# Altium project debanew.PrjPcb
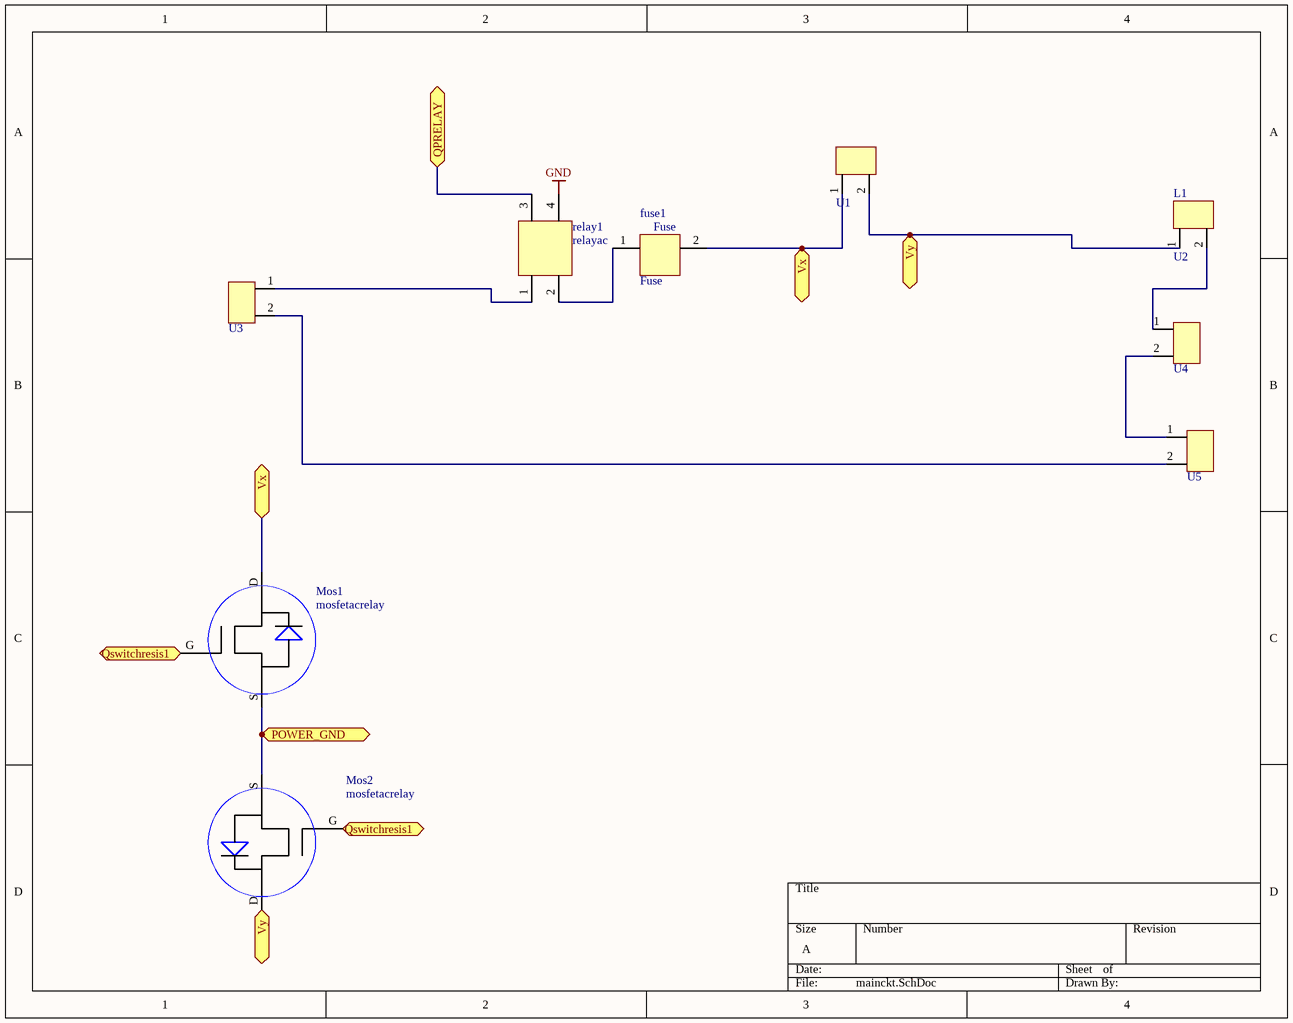
[diagram p0: mainckt.SchDoc]
3 sheets, 51 parts. Net scope: flat (ports and power ports of the same name join across sheets).
Board file: PCB24layer.PcbDoc
Sheets:
  mainckt.SchDoc
  dspinterface.SchDoc
  optoiso.SchDoc

## Sheet mainckt.SchDoc
size A

### Parts
fuse1  Fuse  [fuse10a]
Mos1  mosfetacrelay  [mosfet600v30A]
Mos2  mosfetacrelay  [mosfet600v30A]
relay1  relayac  [acrelay]
U1  Connector 60A  [newconn60A]  (value not drawn)
U2  L1  [newconn60A]
U3  Connector 60A  [newconn60A]  (value not drawn)
U4  Connector 60A  [newconn60A]  (value not drawn)
U5  Connector 60A  [newconn60A]  (value not drawn)

### Ports
POWER_GND (bidir), QPRELAY (bidir), Qswitchresis1 (bidir), Vx (bidir), Vy (bidir)

### Nets
GND: relay1.4
POWER_GND: Mos1.S Mos2.S ; port POWER_GND
Netfuse1_1: fuse1.1 relay1.2
Netfuse1_2: fuse1.2 Mos1.D U1.1 ; port Vx
NetGate_Driver1_6: relay1.3 ; port QPRELAY
NetMos1_G: Mos1.G Mos2.G ; port Qswitchresis1
NetMos2_D: Mos2.D U1.2 U2.1 ; port Vy
Netrelay1_1: relay1.1 U3.1
NetU2_2: U2.2 U4.1
NetU3_2: U3.2 U5.2
NetU4_2: U4.2 U5.1

### Library data of the parts
U2 = Connector 60A

## Sheet dspinterface.SchDoc
size A
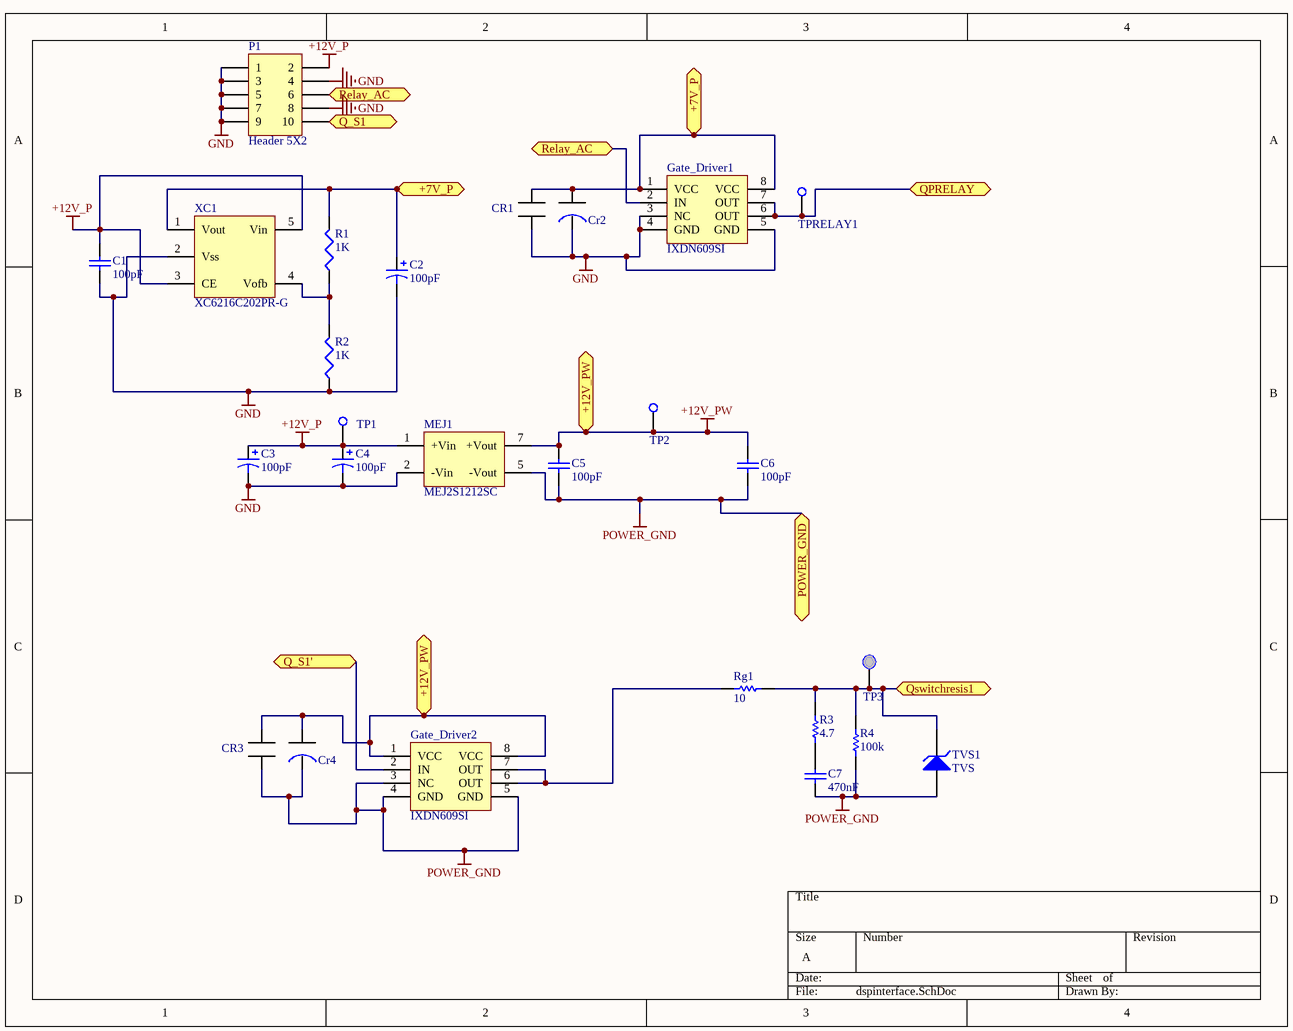
[diagram p1: dspinterface.SchDoc]

### Parts
C1  value 100pF  [C1206]  (hidden comment: Cap Semi)
C2  value 100pF  [C0805]  (hidden comment: Cap Pol3)
C3  value 100pF  [C0805]  (hidden comment: Cap Pol3)
C4  value 100pF  [C0805]  (hidden comment: Cap Pol3)
C5  value 100pF  [C1206]  (hidden comment: Cap Semi)
C6  value 100pF  [C1206]  (hidden comment: Cap Semi)
C7  value 470nF  [Capacitor 0805]  (hidden comment: Cap)
CR1  100nF  [Cap_SMD]  (value not drawn)
Cr2  22uF  [Cap_tantalum]  (value not drawn)
CR3  100nF  [Cap_SMD]  (value not drawn)
Cr4  22uF  [Cap_tantalum]  (value not drawn)
Gate_Driver1  IXDN609SI  [Gate driver _low side]
Gate_Driver2  IXDN609SI  [Gate driver _low side]
MEJ1  MEJ2S1212SC  [MEJ2]
P1  Header 5X2  [HDR2X5]
R1  value 1K  [0805 RES]  (hidden comment: Res3)
R2  value 1K  [0805 RES]  (hidden comment: Res3)
R3  value 4.7  [0805 RES]  (hidden comment: Res1-Metal Oxid Film)
R4  value 100k  [0805 RES]  (hidden comment: Res1-Metal Oxid Film)
Rg1  value 10  [0805 RES]  (hidden comment: Res1-Metal Oxid Film)
TP1  Test Point  [Test Point]  (value not drawn)
TP2  Test Point  [Test Point]  (value not drawn)
TP3  Test point  [Test Point]  (value not drawn)
TPRELAY1  Test Point  [Test Point]  (value not drawn)
TVS1  TVS  [TVS]
XC1  XC6216C202PR-G  [SOT-89-5]

### Ports
+7V_P (bidir), +12V_PW (bidir), POWER_GND (bidir), Q_S1, Q_S1', QPRELAY (bidir), Qswitchresis1 (bidir), Relay_AC (bidir)

### Nets
+12V_P: C1.2 C3.1 C4.1 MEJ1.1(+Vin) P1.2 TP1.1(TP?) XC1.3(CE) XC1.5(Vin)
+12V_PW: C5.2 C6.2 CR3.1 Cr4.1 Gate_Driver2.1(VCC) Gate_Driver2.8(VCC) MEJ1.7(+Vout) TP2.1(TP?) ; port +12V_PW
GND: C1.1 C2.2 C3.2 C4.2 CR1.2 Cr2.2 Gate_Driver1.3(NC) Gate_Driver1.4(GND) Gate_Driver1.5(GND) MEJ1.2(-Vin) P1.1 P1.3 P1.4 P1.5 P1.7 P1.8 P1.9 R2.1 XC1.2(Vss)
POWER_GND: C5.1 C6.1 C7.1 CR3.2 Cr4.2 Gate_Driver2.3(NC) Gate_Driver2.4(GND) Gate_Driver2.5(GND) MEJ1.5(-Vout) R4.1 TVS1.1(A) ; port POWER_GND
NetC2_1: C2.1 CR1.1 Cr2.1 Gate_Driver1.1(VCC) Gate_Driver1.8(VCC) R1.2 XC1.1(Vout) ; port +7V_P
NetC7_2: C7.2 R3.1
NetGate_Driver1_2: Gate_Driver1.2(IN) P1.6 ; port Relay_AC
NetGate_Driver1_6: Gate_Driver1.6(OUT) Gate_Driver1.7(OUT) TPRELAY1.1(TP?) ; port QPRELAY
NetGate_Driver2_2: Gate_Driver2.2(IN) ; port Q_S1'
NetGate_Driver2_6: Gate_Driver2.6(OUT) Gate_Driver2.7(OUT) Rg1.1
NetMos1_G: R3.2 R4.2 Rg1.2 TP3.1 TVS1.2(K) ; port Qswitchresis1
NetOPT1_2: P1.10 ; port Q_S1
NetR1_1: R1.1 R2.2 XC1.4(Vofb)

### Library data of the parts
C1 C5 C6 = Cap Semi: Capacitor (Semiconductor SIM Model); Published: 8-Jun-2000; LatestRevisionDate: 29-May-2009; LatestRevisionNote: IPC-7351 Footprint Added.; PackageReference: C1206; Publisher: Altium Limited; PackageDescription: Chip Capacitor
C2-C4 = Cap Pol3: Polarized Capacitor (Surface Mount); Published: 8-Jun-2000; LatestRevisionDate: 29-May-2009; LatestRevisionNote: IPC-7351 Footprint Added.; PackageReference: C0805; Publisher: Altium Limited; PackageDescription: Chip Capacitor
C7 = Cap: Capacitor; Published: 8-Jun-2000; LatestRevisionDate: 17-Jul-2002; LatestRevisionNote: Re-released for DXP Platform.; PackageReference: RAD-0.3; Publisher: Altium Limited
CR1 CR3 = Cap_SMD
Cr2 Cr4 = Cap_tantalum
Gate_Driver1 Gate_Driver2 = Gate driver low side
MEJ1 = Power supply2
P1 = Header 5X2: Header, 5-Pin, Dual row; LatestRevisionDate: 17-Jul-2002; LatestRevisionNote: Re-released for DXP Platform.; Publisher: Altium Limited
R1 R2 = Res3: Resistor; Published: 8-Jun-2000; LatestRevisionDate: 29-May-2009; LatestRevisionNote: IPC-7351 Footprint Added.; PackageReference: J1-0603; Publisher: Altium Limited; PackageDescription: Chip Resistor
R3 R4 Rg1 = Res1: Resistor; Published: 8-Jun-2000; LatestRevisionDate: 17-Jul-2002; LatestRevisionNote: Re-released for DXP Platform.; PackageReference: AXIAL-0.3; Publisher: Altium Limited
XC1 = power supply

## Sheet optoiso.SchDoc
size A
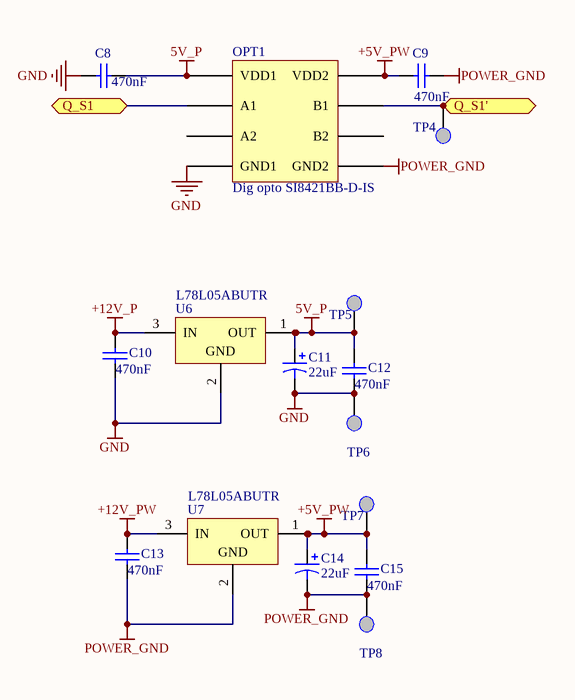
[diagram p2: optoiso.SchDoc]

### Parts
C8  value 470nF  [Capacitor 0805]  (hidden comment: Cap)
C9  value 470nF  [Capacitor 0805]  (hidden comment: Cap)
C10  value 470nF  [Capacitor 0805]  (hidden comment: Cap)
C11  value 22uF  [Cap Tantal 3216]  (hidden comment: Tantalium/T520A226M006ATE090)
C12  value 470nF  [Capacitor 0805]  (hidden comment: Cap)
C13  value 470nF  [Capacitor 0805]  (hidden comment: Cap)
C14  value 22uF  [Cap Tantal 3216]  (hidden comment: Tantalium/T520A226M006ATE090)
C15  value 470nF  [Capacitor 0805]  (hidden comment: Cap)
OPT1  Dig opto SI8421BB-D-IS  [SO8 TS27l2]
TP4  Test point  [Test Point]  (value not drawn)
TP5  Test point  [Test Point]  (value not drawn)
TP6  Test point  [Test Point]  (value not drawn)
TP7  Test point  [Test Point]  (value not drawn)
TP8  Test point  [Test Point]  (value not drawn)
U6  L78L05ABUTR  [Reg SOT-89 +5]
U7  L78L05ABUTR  [Reg SOT-89 +5]

### Ports
Q_S1, Q_S1'

### Nets
5V_P: C8.1 C11.1 C12.2 OPT1.1(VDD1) TP5.1 U6.1(OUT)
+5V_PW: C9.1 C14.1 C15.2 OPT1.8(VDD2) TP7.1 U7.1(OUT)
+12V_P: C10.2 U6.3(IN)
+12V_PW: C13.2 U7.3(IN)
GND: C8.2 C10.1 C11.2 C12.1 OPT1.4(GND1) TP6.1 U6.2(GND)
POWER_GND: C9.2 C13.1 C14.2 C15.1 OPT1.5(GND2) TP8.1 U7.2(GND)
NetGate_Driver2_2: OPT1.7(B1) TP4.1 ; port Q_S1'
NetOPT1_2: OPT1.2(A1) ; port Q_S1

Not connected (* = marked no-connect by the designer): OPT1 3(A2) 6(B2)

### Library data of the parts
C8-C10 C12 C13 C15 = Cap: Capacitor; Published: 8-Jun-2000; LatestRevisionDate: 17-Jul-2002; LatestRevisionNote: Re-released for DXP Platform.; PackageReference: RAD-0.3; Publisher: Altium Limited
C11 C14 = Cap Pol1: Polarized Capacitor (Radial); Published: 8-Jun-2000; LatestRevisionDate: 17-Jul-2002; LatestRevisionNote: Re-released for DXP Platform.; PackageReference: RB7.6-15; Publisher: Altium Limited
OPT1 = Component_1
U6 U7 = L78L05ABZ: Positive Voltage Regulator; Published: 24-Aug-2001; LatestRevisionDate: 17-Jul-2002; LatestRevisionNote: Re-released for DXP Platform.; DatasheetVersion: Feb-1999; PackageReference: TO92; Publisher: Altium Limited; PackageDescription: TO, Flat Index; 3 In-Line, Axial Leads; Body Dia. 4.8mm; Leads 0.51 x 0.51 mm (max); ComponentLink1Description: Manufacturer Link; ComponentLink1URL: http://www.st.com/

## Nets that join several sheets
+12V_P: dspinterface (8 pins), optoiso (C10.2 U6.3)
+12V_PW: dspinterface (8 pins), optoiso (C13.2 U7.3)
GND: mainckt (relay1.4), dspinterface (19 pins), optoiso (7 pins)
POWER_GND: mainckt (Mos1.S Mos2.S), dspinterface (11 pins), optoiso (7 pins)
NetGate_Driver1_6: mainckt (relay1.3), dspinterface (Gate_Driver1.6 Gate_Driver1.7 TPRELAY1.1)
NetGate_Driver2_2: dspinterface (Gate_Driver2.2), optoiso (OPT1.7 TP4.1)
NetMos1_G: mainckt (Mos1.G Mos2.G), dspinterface (5 pins)
NetOPT1_2: dspinterface (P1.10), optoiso (OPT1.2)